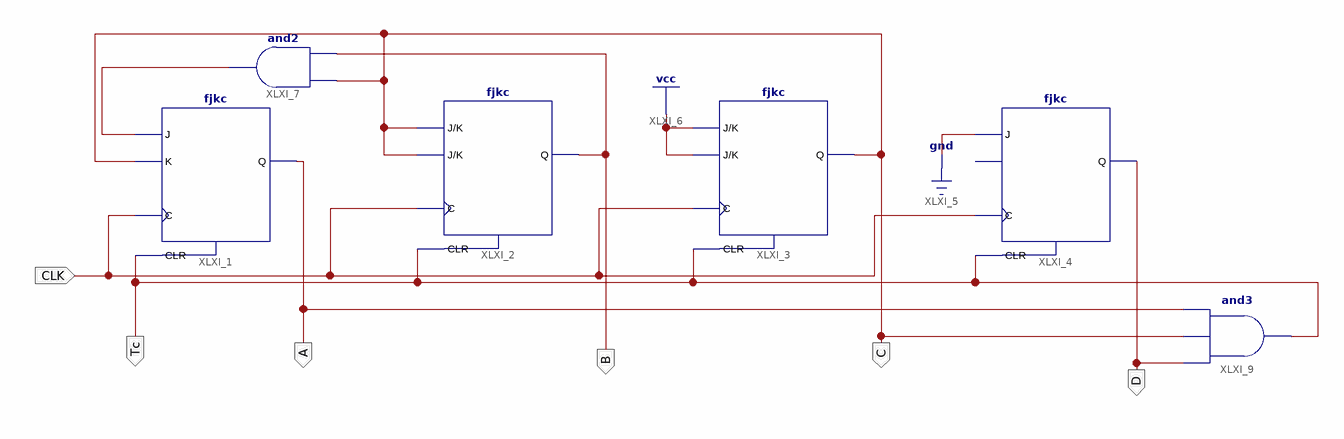
[diagram p0: schematic sheet 1]
// Xilinx ISE schematic CounterEven.sch (spartan6) as structural Verilog: 6 symbols, 6 ports
module CounterEven (
  input  CLK,
  output C,
  output B,
  output Tc,
  output A,
  output D
);

  wire XLXN_6;

  fjkc XLXI_1 (.C(CLK), .CLR(Tc), .J(XLXN_6), .K(C), .Q(A));
  fjkc XLXI_2 (.C(CLK), .CLR(Tc), .J(C), .K(C), .Q(B));
  fjkc XLXI_3 (.C(CLK), .CLR(Tc), .J(1'b1), .K(1'b1), .Q(C));
  fjkc XLXI_4 (.C(CLK), .CLR(Tc), .J(1'b0), .Q(D));  // open: K
  and XLXI_7 (XLXN_6, B, C);
  and XLXI_9 (Tc, D, C, A);
endmodule
